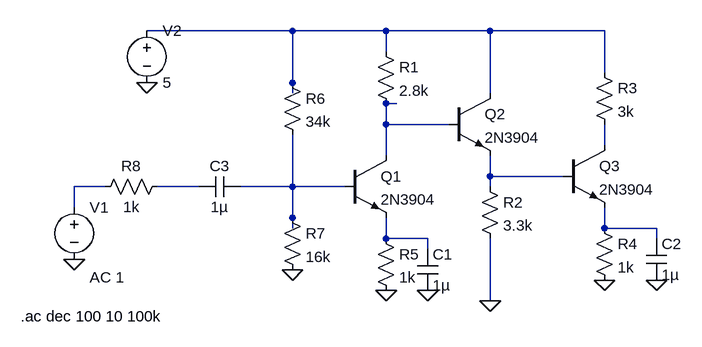
[diagram p0: schematic 2.asc]
2.asc, the LTspice schematic file:
Version 4
SHEET 1 880 680
WIRE -64 -80 -288 -80
WIRE 80 -80 -64 -80
WIRE 240 -80 80 -80
WIRE 416 -80 240 -80
WIRE 80 -48 80 -80
WIRE 416 -16 416 -80
WIRE -64 0 -64 -80
WIRE -64 16 -64 0
WIRE 240 16 240 -80
WIRE 96 32 80 32
WIRE 80 64 80 32
WIRE 176 64 80 64
WIRE 416 96 416 64
WIRE 80 112 80 64
WIRE 240 144 240 112
WIRE 352 144 240 144
WIRE -352 160 -400 160
WIRE -208 160 -272 160
WIRE -64 160 -64 80
WIRE -64 160 -144 160
WIRE 16 160 -64 160
WIRE 240 160 240 144
WIRE -400 192 -400 160
WIRE -64 208 -64 160
WIRE -64 224 -64 208
WIRE 416 224 416 192
WIRE 496 224 416 224
WIRE 80 240 80 208
WIRE 144 240 80 240
WIRE 496 240 496 224
WIRE 144 256 144 240
WIRE 240 336 240 240
FLAG 80 320 0
FLAG 144 320 0
FLAG 240 336 0
FLAG 416 304 0
FLAG 496 304 0
FLAG -288 0 0
FLAG -400 272 0
FLAG -64 288 0
SYMBOL npn 16 112 R0
SYMATTR InstName Q1
SYMATTR Value 2N3904
SYMBOL npn 176 16 R0
SYMATTR InstName Q2
SYMATTR Value 2N3904
SYMBOL npn 352 96 R0
SYMATTR InstName Q3
SYMATTR Value 2N3904
SYMBOL res 64 -64 R0
SYMATTR InstName R1
SYMATTR Value 2.8k
SYMBOL res 224 144 R0
SYMATTR InstName R2
SYMATTR Value 3.3k
SYMBOL res 400 -32 R0
SYMATTR InstName R3
SYMATTR Value 3k
SYMBOL res 400 208 R0
SYMATTR InstName R4
SYMATTR Value 1k
SYMBOL res 64 224 R0
SYMATTR InstName R5
SYMATTR Value 1k
SYMBOL cap 128 256 R0
SYMATTR InstName C1
SYMATTR Value 1µ
SYMBOL cap 480 240 R0
SYMATTR InstName C2
SYMATTR Value 1µ
SYMBOL res -80 -16 R0
SYMATTR InstName R6
SYMATTR Value 34k
SYMBOL res -80 192 R0
SYMATTR InstName R7
SYMATTR Value 16k
SYMBOL res -256 144 R90
WINDOW 0 0 56 VBottom 2
WINDOW 3 32 56 VTop 2
SYMATTR InstName R8
SYMATTR Value 1k
SYMBOL voltage -400 176 R0
WINDOW 123 24 124 Left 2
WINDOW 39 0 0 Left 2
SYMATTR InstName V1
SYMATTR Value ""
SYMATTR Value2 AC 1
SYMBOL voltage -288 -96 R0
WINDOW 123 0 0 Left 2
WINDOW 39 0 0 Left 2
SYMATTR InstName V2
SYMATTR Value 5
SYMBOL cap -144 144 R90
WINDOW 0 0 32 VBottom 2
WINDOW 3 32 32 VTop 2
SYMATTR InstName C3
SYMATTR Value 1µ
TEXT -482 360 Left 2 !.ac dec 100 10 100k

The netlist it stands for:
* 2.asc
Q1 N002 N007 N009 0 2N3904
Q2 N001 N002 N004 0 2N3904
Q3 N003 N004 N008 0 2N3904
R1 N001 N002 2.8k
R2 N004 0 3.3k
R3 N001 N003 3k
R4 N008 0 1k
R5 N009 0 1k
C1 N009 0 1µ
C2 N008 0 1µ
R6 N001 N007 34k
R7 N007 0 16k
R8 N006 N005 1k
V1 N005 0 AC 1
V2 N001 0 5
C3 N007 N006 1µ
.model NPN NPN
.model PNP PNP
.lib standard.bjt
.ac dec 100 10 100k
.backanno
.end